# Altium schematic sheet 总图.SchDoc
size A4
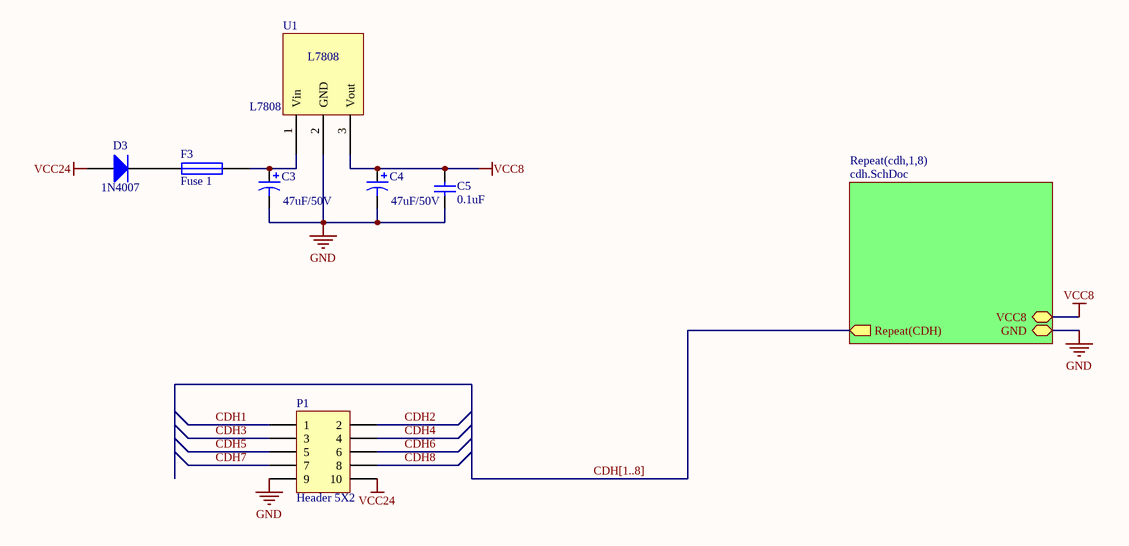
[diagram p0: 总图.SchDoc]

## Parts
C3  value 47uF/50V  [CAP-6*12]  (hidden comment: Cap Pol3)
C4  value 47uF/50V  [CAP-6*12]  (hidden comment: Cap Pol3)
C5  value 0.1uF  [C0805]  (hidden comment: Cap Semi)
D3  1N4007  [DIDOE]
F3  Fuse 1  [1206]
P1  Header 5X2  [HDR2X5]
U1  L7808  [TO-220]

## Sub-sheets
Repeat(cdh,1,8) = cdh.SchDoc: GND (bidir), VCC8 (bidir), Repeat(CDH) (out)

## Nets
GND: C3.2 C4.2 C5.1 P1.9 U1.2(GND) ; sheet Repeat(cdh,1,8)/GND
VCC8: C4.1 C5.2 U1.3(Vout) ; sheet Repeat(cdh,1,8)/VCC8
VCC24: D3.1(A) P1.10
CDH1: P1.1
CDH2: P1.2
CDH3: P1.3
CDH4: P1.4
CDH5: P1.5
CDH6: P1.6
CDH7: P1.7
CDH8: P1.8
NetC3_1: C3.1 F3.2 U1.1(Vin)
NetD3_2: D3.2(K) F3.1

## Buses and harness runs
bus CDH[1..8]

## Library data of the parts
C3 C4 = Cap Pol3: Polarized Capacitor (Surface Mount); Published: 8-Jun-2000; LatestRevisionDate: 29-May-2009; LatestRevisionNote: IPC-7351 Footprint Added.; PackageReference: C0805; Publisher: Altium Limited; PackageDescription: Chip Capacitor
C5 = Cap Semi: Capacitor (Semiconductor SIM Model); Published: 8-Jun-2000; LatestRevisionDate: 29-May-2009; LatestRevisionNote: IPC-7351 Footprint Added.; PackageReference: C1206; Publisher: Altium Limited; PackageDescription: Chip Capacitor
D3 = Diode 1N4007: 1 Amp General Purpose Rectifier; Published: 8-Jun-2000; LatestRevisionDate: 17-Jul-2002; LatestRevisionNote: Re-released for DXP Platform.; DatasheetVersion: 1998; PackageVersion: Aug-1999; PackageReference: DO-41; Publisher: Altium Limited; PackageDescription: Diode, Axial; Body 5.2 x 2.7 mm (LxDia. max), Lead Dia. 0.86 mm (max); Code_JEDEC: DO-204-AL; ComponentLink1Description: Manufacturer Link; ComponentLink1URL: http://www.fairchildsemi.com/; ComponentLink2Description: Datasheet; ComponentLink2URL: http://www.fairchildsemi.com/ds/1N%2F1N4001.pdf
F3 = Fuse 1: Fuse; Published: 8-Jun-2000; LatestRevisionDate: 17-Jul-2002; LatestRevisionNote: Re-released for DXP Platform.; PackageReference: PIN-W2/E2.8; Publisher: Altium Limited; PackageDescription: Thru-Hole; 2 Leads
P1 = Header 5X2: Header, 5-Pin, Dual row; LatestRevisionDate: 17-Jul-2002; LatestRevisionNote: Re-released for DXP Platform.; Publisher: Altium Limited